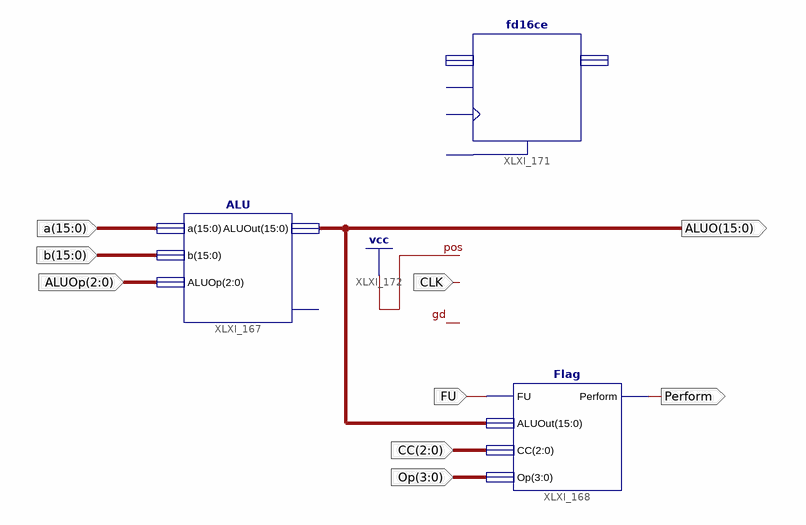
[diagram p0: schematic sheet 1]
// Xilinx ISE schematic IntegratedTestALU_Flag.sch (spartan3e) as structural Verilog: 3 symbols, 9 ports
module IntegratedTestALU_Flag (
  input  [2:0] ALUOp,
  input  FU,
  input  [3:0] Op,
  input  [2:0] CC,
  input  [15:0] a,
  input  [15:0] b,
  input  CLK,
  output Perform,
  output [15:0] ALUO
);

  ALU XLXI_167 (.a(a), .b(b), .ALUOp(ALUOp), .ALUOut(ALUO));  // open: Overflow
  Flag XLXI_168 (.FU(FU), .ALUOut(ALUO), .CC(CC), .Op(Op), .Perform(Perform));
  fd16ce XLXI_171 ();  // open: C, CE, CLR, D, Q
endmodule
